# Altium schematic sheet Main.SchDoc
size A4; SheetNumber: 1; SheetTotal: 9
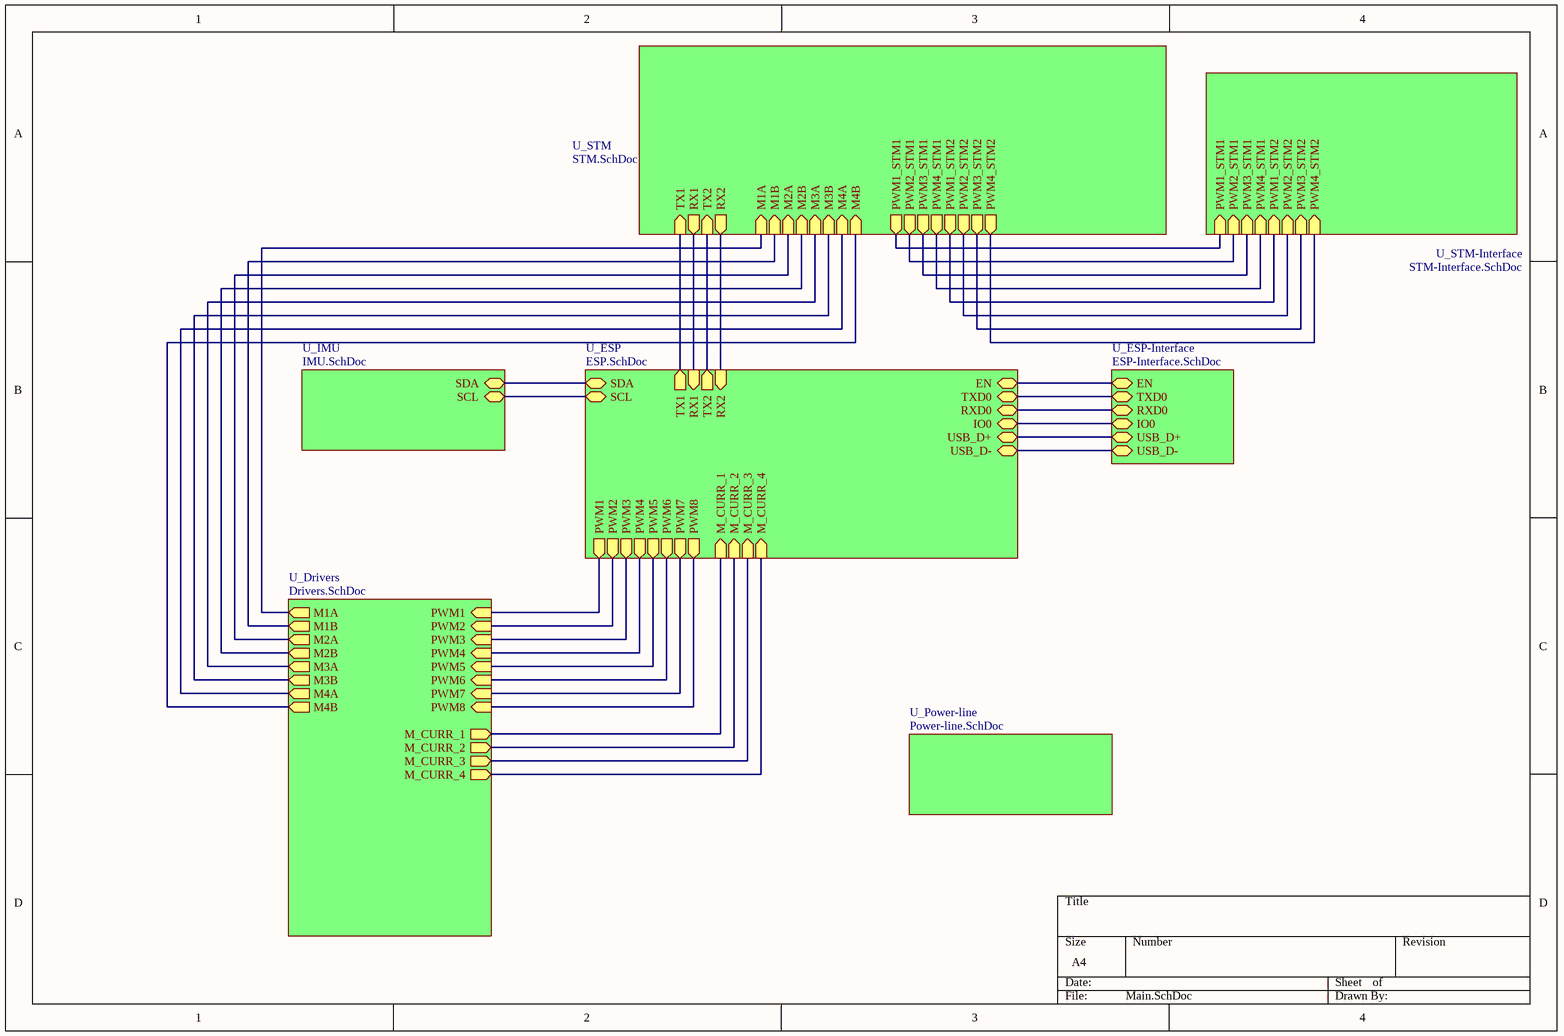
[diagram p0: Main.SchDoc]

## Sub-sheets
U_Drivers = Drivers.SchDoc: PWM1 (in), PWM2 (in), PWM3 (in), PWM4 (in), PWM5 (in), PWM6 (in), PWM7 (in), PWM8 (in), M_CURR_1 (out), M_CURR_2 (out), M_CURR_3 (out), M_CURR_4 (out), M1A (out), M1B (out), M2A (out), M2B (out), M3A (out), M3B (out), M4A (out), M4B (out)
U_ESP = ESP.SchDoc: EN (bidir), TXD0 (bidir), RXD0 (bidir), IO0 (bidir), USB_D+ (bidir), USB_D- (bidir), SDA (bidir), SCL (bidir), TX1 (out), TX2 (out), RX1 (in), RX2 (in), PWM1 (out), PWM2 (out), PWM3 (out), PWM4 (out), PWM5 (out), PWM6 (out), PWM7 (out), PWM8 (out), M_CURR_1 (in), M_CURR_2 (in), M_CURR_3 (in), M_CURR_4 (in)
U_ESP-Interface = ESP-Interface.SchDoc: EN (bidir), TXD0 (bidir), RXD0 (bidir), IO0 (bidir), USB_D+ (bidir), USB_D- (bidir)
U_IMU = IMU.SchDoc: SDA (bidir), SCL (bidir)
U_Power-line = Power-line.SchDoc: no entries
U_STM = STM.SchDoc: TX1 (in), RX1 (out), TX2 (in), RX2 (out), M1A (in), M1B (in), M2A (in), M2B (in), M3A (in), M3B (in), M4A (in), M4B (in), PWM1_STM1 (out), PWM2_STM1 (out), PWM3_STM1 (out), PWM4_STM1 (out), PWM1_STM2 (out), PWM2_STM2 (out), PWM3_STM2 (out), PWM4_STM2 (out)
U_STM-Interface = STM-Interface.SchDoc: PWM1_STM1 (in), PWM2_STM1 (in), PWM3_STM1 (in), PWM4_STM1 (in), PWM1_STM2 (in), PWM2_STM2 (in), PWM3_STM2 (in), PWM4_STM2 (in)

## Nets
(unnamed): sheet U_ESP/EN, sheet U_ESP-Interface/EN
(unnamed): sheet U_ESP/TXD0, sheet U_ESP-Interface/TXD0
(unnamed): sheet U_ESP/RXD0, sheet U_ESP-Interface/RXD0
(unnamed): sheet U_ESP/IO0, sheet U_ESP-Interface/IO0
(unnamed): sheet U_ESP/USB_D+, sheet U_ESP-Interface/USB_D+
(unnamed): sheet U_ESP/USB_D-, sheet U_ESP-Interface/USB_D-
(unnamed): sheet U_ESP/SDA, sheet U_IMU/SDA
(unnamed): sheet U_ESP/SCL, sheet U_IMU/SCL
(unnamed): sheet U_ESP/TX1, sheet U_STM/TX1
(unnamed): sheet U_ESP/TX2, sheet U_STM/TX2
(unnamed): sheet U_ESP/RX1, sheet U_STM/RX1
(unnamed): sheet U_ESP/RX2, sheet U_STM/RX2
(unnamed): sheet U_ESP/PWM1, sheet U_Drivers/PWM1
(unnamed): sheet U_ESP/PWM2, sheet U_Drivers/PWM2
(unnamed): sheet U_ESP/PWM3, sheet U_Drivers/PWM3
(unnamed): sheet U_ESP/PWM4, sheet U_Drivers/PWM4
(unnamed): sheet U_ESP/PWM5, sheet U_Drivers/PWM5
(unnamed): sheet U_ESP/PWM6, sheet U_Drivers/PWM6
(unnamed): sheet U_ESP/PWM7, sheet U_Drivers/PWM7
(unnamed): sheet U_ESP/PWM8, sheet U_Drivers/PWM8
(unnamed): sheet U_ESP/M_CURR_1, sheet U_Drivers/M_CURR_1
(unnamed): sheet U_ESP/M_CURR_2, sheet U_Drivers/M_CURR_2
(unnamed): sheet U_ESP/M_CURR_3, sheet U_Drivers/M_CURR_3
(unnamed): sheet U_ESP/M_CURR_4, sheet U_Drivers/M_CURR_4
(unnamed): sheet U_STM/M1A, sheet U_Drivers/M1A
(unnamed): sheet U_STM/M1B, sheet U_Drivers/M1B
(unnamed): sheet U_STM/M2A, sheet U_Drivers/M2A
(unnamed): sheet U_STM/M2B, sheet U_Drivers/M2B
(unnamed): sheet U_STM/M3A, sheet U_Drivers/M3A
(unnamed): sheet U_STM/M3B, sheet U_Drivers/M3B
(unnamed): sheet U_STM/M4A, sheet U_Drivers/M4A
(unnamed): sheet U_STM/M4B, sheet U_Drivers/M4B
(unnamed): sheet U_STM/PWM1_STM1, sheet U_STM-Interface/PWM1_STM1
(unnamed): sheet U_STM/PWM2_STM1, sheet U_STM-Interface/PWM2_STM1
(unnamed): sheet U_STM/PWM3_STM1, sheet U_STM-Interface/PWM3_STM1
(unnamed): sheet U_STM/PWM4_STM1, sheet U_STM-Interface/PWM4_STM1
(unnamed): sheet U_STM/PWM1_STM2, sheet U_STM-Interface/PWM1_STM2
(unnamed): sheet U_STM/PWM2_STM2, sheet U_STM-Interface/PWM2_STM2
(unnamed): sheet U_STM/PWM3_STM2, sheet U_STM-Interface/PWM3_STM2
(unnamed): sheet U_STM/PWM4_STM2, sheet U_STM-Interface/PWM4_STM2